# EasyEDA schematic SCH_mysplitkeyboard-right(sub).json
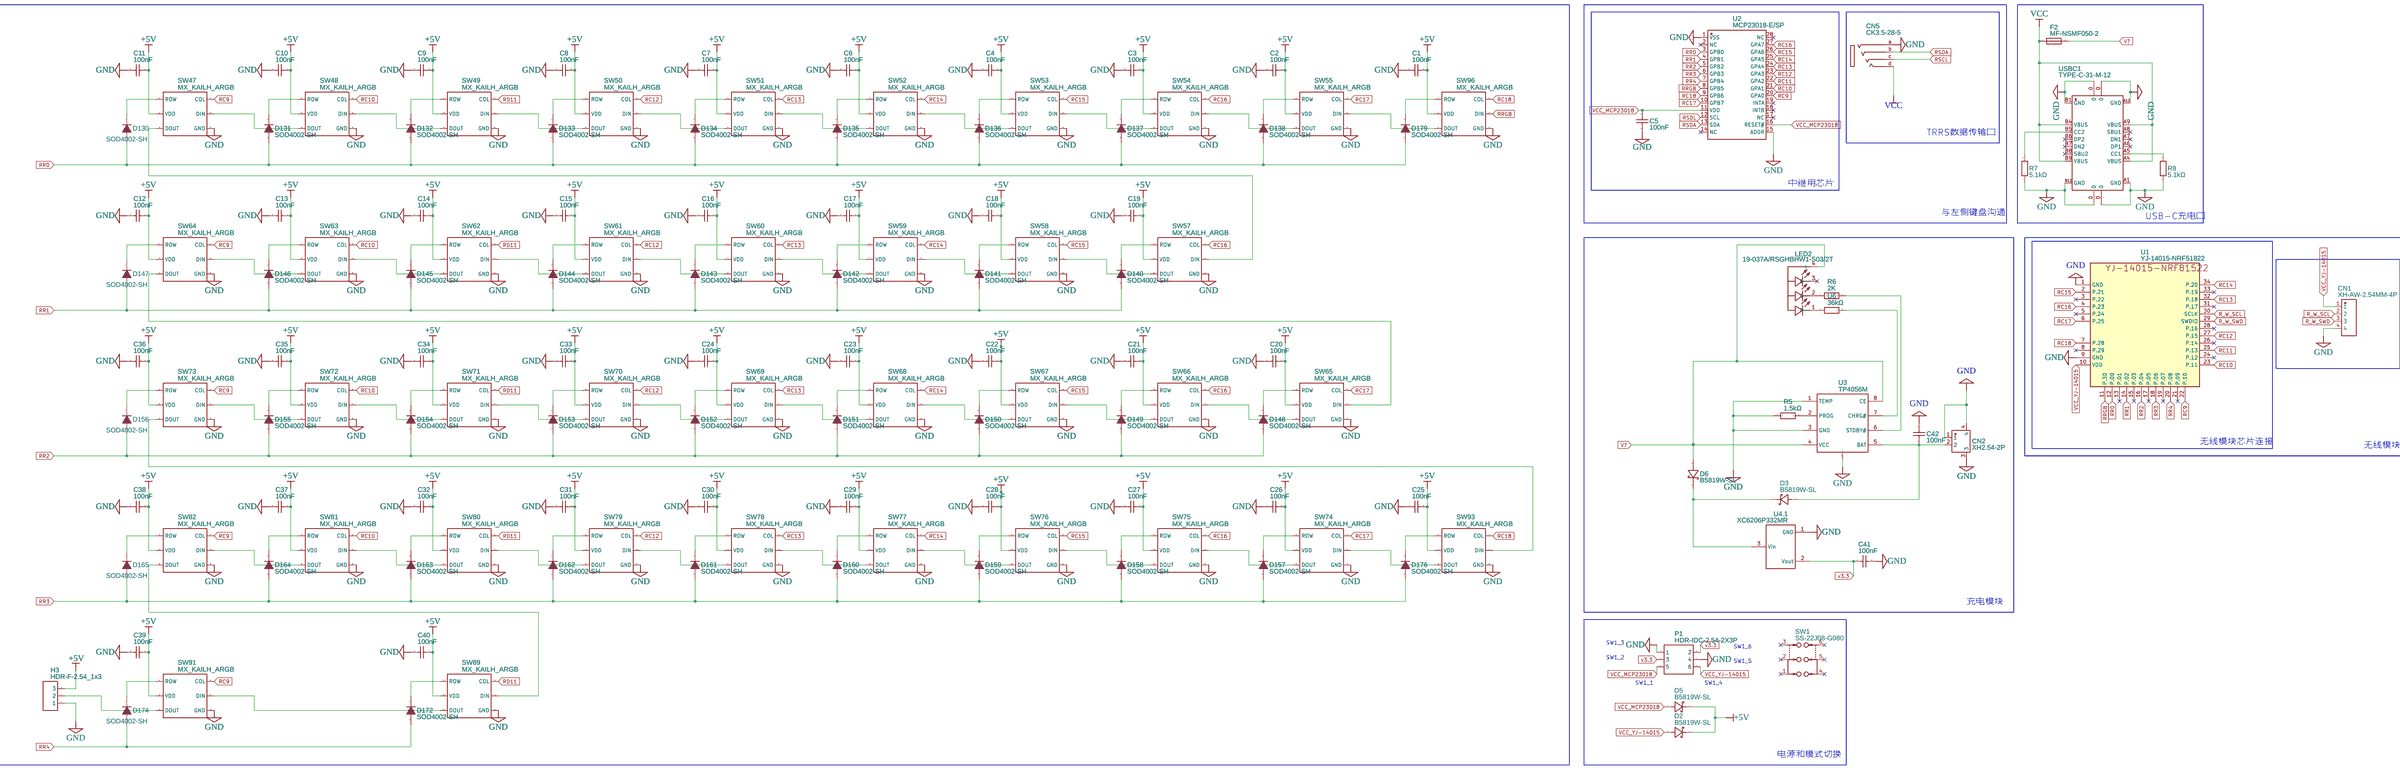
[diagram p0: schematic sheet]

## Parts
C1  100nF  [C0805]
C2  100nF  [C0805]
C3  100nF  [C0805]
C4  100nF  [C0805]
C5  100nF  [C0805]
C6  100nF  [C0805]
C7  100nF  [C0805]
C8  100nF  [C0805]
C9  100nF  [C0805]
C10  100nF  [C0805]
C11  100nF  [C0805]
C12  100nF  [C0805]
C13  100nF  [C0805]
C14  100nF  [C0805]
C15  100nF  [C0805]
C16  100nF  [C0805]
C17  100nF  [C0805]
C18  100nF  [C0805]
C19  100nF  [C0805]
C20  100nF  [C0805]
C21  100nF  [C0805]
C22  100nF  [C0805]
C23  100nF  [C0805]
C24  100nF  [C0805]
C25  100nF  [C0805]
C26  100nF  [C0805]
C27  100nF  [C0805]
C28  100nF  [C0805]
C29  100nF  [C0805]
C30  100nF  [C0805]
C31  100nF  [C0805]
C32  100nF  [C0805]
C33  100nF  [C0805]
C34  100nF  [C0805]
C35  100nF  [C0805]
C36  100nF  [C0805]
C37  100nF  [C0805]
C38  100nF  [C0805]
C39  100nF  [C0805]
C40  100nF  [C0805]
C41  100nF  [C0805]
C42  100nF  [C0805]
CN1  XH-AW-2.54MM-4P  [CONN-TH_4P-P2.54_XH-AW-2.54MM-4P]
CN2  XH2.54-2P  [CONN-SMD_2P-P2.50-WT]
CN5  CK3.5-28-5  [AUDIO-TH_CK3.5-28-5]
D2  B5819W-SL  [SOD-123_L2.8-W1.8-LS3.7-RD]
D3  B5819W-SL  [SOD-123_L2.8-W1.8-LS3.7-RD]
D5  B5819W-SL  [SOD-123_L2.8-W1.8-LS3.7-RD]
D6  B5819W-SL  [SOD-123_L2.8-W1.8-LS3.7-RD]
D130  SOD4002-SH  [SOD-123F_L2.8-W1.8-LS3.7-RD]
D131  SOD4002-SH  [SOD-123F_L2.8-W1.8-LS3.7-RD]
D132  SOD4002-SH  [SOD-123F_L2.8-W1.8-LS3.7-RD]
D133  SOD4002-SH  [SOD-123F_L2.8-W1.8-LS3.7-RD]
D134  SOD4002-SH  [SOD-123F_L2.8-W1.8-LS3.7-RD]
D135  SOD4002-SH  [SOD-123F_L2.8-W1.8-LS3.7-RD]
D136  SOD4002-SH  [SOD-123F_L2.8-W1.8-LS3.7-RD]
D137  SOD4002-SH  [SOD-123F_L2.8-W1.8-LS3.7-RD]
D138  SOD4002-SH  [SOD-123F_L2.8-W1.8-LS3.7-RD]
D140  SOD4002-SH  [SOD-123F_L2.8-W1.8-LS3.7-RD]
D141  SOD4002-SH  [SOD-123F_L2.8-W1.8-LS3.7-RD]
D142  SOD4002-SH  [SOD-123F_L2.8-W1.8-LS3.7-RD]
D143  SOD4002-SH  [SOD-123F_L2.8-W1.8-LS3.7-RD]
D144  SOD4002-SH  [SOD-123F_L2.8-W1.8-LS3.7-RD]
D145  SOD4002-SH  [SOD-123F_L2.8-W1.8-LS3.7-RD]
D146  SOD4002-SH  [SOD-123F_L2.8-W1.8-LS3.7-RD]
D147  SOD4002-SH  [SOD-123F_L2.8-W1.8-LS3.7-RD]
D148  SOD4002-SH  [SOD-123F_L2.8-W1.8-LS3.7-RD]
D149  SOD4002-SH  [SOD-123F_L2.8-W1.8-LS3.7-RD]
D150  SOD4002-SH  [SOD-123F_L2.8-W1.8-LS3.7-RD]
D151  SOD4002-SH  [SOD-123F_L2.8-W1.8-LS3.7-RD]
D152  SOD4002-SH  [SOD-123F_L2.8-W1.8-LS3.7-RD]
D153  SOD4002-SH  [SOD-123F_L2.8-W1.8-LS3.7-RD]
D154  SOD4002-SH  [SOD-123F_L2.8-W1.8-LS3.7-RD]
D155  SOD4002-SH  [SOD-123F_L2.8-W1.8-LS3.7-RD]
D156  SOD4002-SH  [SOD-123F_L2.8-W1.8-LS3.7-RD]
D157  SOD4002-SH  [SOD-123F_L2.8-W1.8-LS3.7-RD]
D158  SOD4002-SH  [SOD-123F_L2.8-W1.8-LS3.7-RD]
D159  SOD4002-SH  [SOD-123F_L2.8-W1.8-LS3.7-RD]
D160  SOD4002-SH  [SOD-123F_L2.8-W1.8-LS3.7-RD]
D161  SOD4002-SH  [SOD-123F_L2.8-W1.8-LS3.7-RD]
D162  SOD4002-SH  [SOD-123F_L2.8-W1.8-LS3.7-RD]
D163  SOD4002-SH  [SOD-123F_L2.8-W1.8-LS3.7-RD]
D164  SOD4002-SH  [SOD-123F_L2.8-W1.8-LS3.7-RD]
D165  SOD4002-SH  [SOD-123F_L2.8-W1.8-LS3.7-RD]
D172  SOD4002-SH  [SOD-123F_L2.8-W1.8-LS3.7-RD]
D174  SOD4002-SH  [SOD-123F_L2.8-W1.8-LS3.7-RD]
D176  SOD4002-SH  [SOD-123F_L2.8-W1.8-LS3.7-RD]
D179  SOD4002-SH  [SOD-123F_L2.8-W1.8-LS3.7-RD]
F2  MF-NSMF050-2  [F1206]
H3  HDR-F-2.54_1x3  [HDR-F-2.54_1X3]
LED2  19-037A/RSGHBHW1-S03/2T  [LED-ARRAY-SMD_4P-L1.6-W1.6-TR_EVERLIGHT_RSGHBHW1-S03]
P1  HDR-IDC-2.54-2X3P  [IDC-TH_6P-P2.54_C11214]
R5  1.5kΩ  [R0805]
R6  2K  [R0805]
R7  5.1kΩ  [R0805]
R8  5.1kΩ  [R0805]
SW1  SS-22J08-G080  [SW-TH_G-SWITCH_SS-22J08-G080]
SW47  MX_KAILH_ARGB  [MX_KAILH_ARGB_V1]
SW48  MX_KAILH_ARGB  [MX_KAILH_ARGB_V1]
SW49  MX_KAILH_ARGB  [MX_KAILH_ARGB_V1]
SW50  MX_KAILH_ARGB  [MX_KAILH_ARGB_V1]
SW51  MX_KAILH_ARGB  [MX_KAILH_ARGB_V1]
SW52  MX_KAILH_ARGB  [MX_KAILH_ARGB_V1]
SW53  MX_KAILH_ARGB  [MX_KAILH_ARGB_V1]
SW54  MX_KAILH_ARGB  [MX_KAILH_ARGB_V1]
SW55  MX_KAILH_ARGB  [MX_KAILH_ARGB_V1]
SW57  MX_KAILH_ARGB  [MX_KAILH_ARGB_V1]
SW58  MX_KAILH_ARGB  [MX_KAILH_ARGB_V1]
SW59  MX_KAILH_ARGB  [MX_KAILH_ARGB_V1]
SW60  MX_KAILH_ARGB  [MX_KAILH_ARGB_V1]
SW61  MX_KAILH_ARGB  [MX_KAILH_ARGB_V1]
SW62  MX_KAILH_ARGB  [MX_KAILH_ARGB_V1]
SW63  MX_KAILH_ARGB  [MX_KAILH_ARGB_V1]
SW64  MX_KAILH_ARGB  [MX_KAILH_ARGB_V1]
SW65  MX_KAILH_ARGB  [MX_KAILH_ARGB_V1]
SW66  MX_KAILH_ARGB  [MX_KAILH_ARGB_V1]
SW67  MX_KAILH_ARGB  [MX_KAILH_ARGB_V1]
SW68  MX_KAILH_ARGB  [MX_KAILH_ARGB_V1]
SW69  MX_KAILH_ARGB  [MX_KAILH_ARGB_V1]
SW70  MX_KAILH_ARGB  [MX_KAILH_ARGB_V1]
SW71  MX_KAILH_ARGB  [MX_KAILH_ARGB_V1]
SW72  MX_KAILH_ARGB  [MX_KAILH_ARGB_V1]
SW73  MX_KAILH_ARGB  [MX_KAILH_ARGB_V1]
SW74  MX_KAILH_ARGB  [MX_KAILH_ARGB_V1]
SW75  MX_KAILH_ARGB  [MX_KAILH_ARGB_V1]
SW76  MX_KAILH_ARGB  [MX_KAILH_ARGB_V1]
SW77  MX_KAILH_ARGB  [MX_KAILH_ARGB_V1]
SW78  MX_KAILH_ARGB  [MX_KAILH_ARGB_V1]
SW79  MX_KAILH_ARGB  [MX_KAILH_ARGB_V1]
SW80  MX_KAILH_ARGB  [MX_KAILH_ARGB_V1]
SW81  MX_KAILH_ARGB  [MX_KAILH_ARGB_V1]
SW82  MX_KAILH_ARGB  [MX_KAILH_ARGB_V1]
SW89  MX_KAILH_ARGB  [MX_KAILH_ARGB_V1]
SW91  MX_KAILH_ARGB  [MX_KAILH_ARGB_V1]
SW93  MX_KAILH_ARGB  [MX_KAILH_ARGB_V1]
SW96  MX_KAILH_ARGB  [MX_KAILH_ARGB_V1]
U1  YJ-14015-NRF51822  [YJ-14015-NRF51822]
U2  MCP23018-E/SP  [SPDIP-28_L34.7-W7.2-P2.54-LS7.9-BL]
U3  TP4056M  [MSOP-8_L3.0-W3.0-P0.65-LS5.0-BL-EP]
U4  XC6206P332MR  [SOT-23-3_L2.9-W1.6-P1.90-LS2.8-BR]  (section 1)
U6  36kΩ  [R0805]
USBC1  TYPE-C-31-M-12  [USB-C_SMD-TYPE-C-31-M-12]

## Library data of the parts
C1-C42 = C0805C104K5RACAUTO: Supplier: LCSC; Manufacturer: KEMET; Contributor: LCSC; Supplier Part: C129641; JLCPCB Part Class: Extended Part
CN1 = XH-AW-2.54MM-4P: Supplier: LCSC; Supplier Part: C9900018797; Manufacturer: null; JLCPCB Part Class: Extended Part; Contributor: lcsc
CN2 = XH2.54-2P: Supplier: LCSC; Supplier Part: C9900004348; Manufacturer: 深圳华利; link: https://item.taobao.com/item.htm?id=584598398852&price=0.1-0.18&sourceType=item&detailSharePosition=interactBar&sourceType=item&suid=31843e8f-a3cd-4e51-8449-826e7ea887a9&shareUniqueId=14191166517&ut_s; Contributor: LCSC; JLCPCB Part Class: Extended Part
CN5 = CK3.5-28-5: Supplier: LCSC; Supplier Part: C718048; Manufacturer: JINJIA; Contributor: LCSC; JLCPCB Part Class: Extended Part
D2 D3 D5 D6 = B5819W-SL: Supplier: LCSC; Supplier Part: C779676; Manufacturer: ZRE; Contributor: LCSC; JLCPCB Part Class: Extended Part
D130-D138 D140-D165 D172 D174 D176 D179 = SOD4002-SH: Supplier: LCSC; Manufacturer: LRC; Contributor: LCSC; Supplier Part: C154996; JLCPCB Part Class: Extended Part
F2 = MF-NSMF050-2: Supplier: LCSC; Manufacturer: BOURNS; Supplier Part: C75464; JLCPCB Part Class: Extended Part
H3 = HDR-F-2.54_1x3: Supplier Part: C146690; Supplier: LCSC; Contributor: LCEDA_Lib
LED2 = 19-037A/RSGHBHW1-S03/2T: Supplier: LCSC; Supplier Part: C282128; Manufacturer: Everlight Elec; Contributor: LCSC; JLCPCB Part Class: Extended Part
P1 = HDR-IDC-2.54-2X3P: Supplier: LCSC; Manufacturer: BOOMELE; Manufacturer Part: 2X3 2.54mm IDC Box; image: //image.lceda.cn/szlcsc/C11214.jpg; Supplier Part: C11214
R5 = RMC08051.5K1%N: Supplier: LCSC; Supplier Part: C269739; Manufacturer: Tyohm; Resistance (Ohms): 1.5K; Contributor: LCSC; JLCPCB Part Class: Extended Part
R6 = CR0805-FX-2001ELF: Supplier: LCSC; Supplier Part: C203834; Manufacturer: BOURNS; Contributor: LCSC; JLCPCB Part Class: Extended Part; Resistance: 2kΩ
R7 R8 = AECR0805F5K10K9: Supplier: LCSC; Supplier Part: C328405; Manufacturer: ResistorToday; Resistance (Ohms): 5.1K; Contributor: LCSC; JLCPCB Part Class: Extended Part
SW1 = SS-22J08-G080: Supplier: LCSC; Supplier Part: C2848898; Manufacturer: G-Switch(品赞); Contributor: LCSC
SW47-SW55 SW57-SW82 SW89 SW91 SW93 SW96 = MX_KAILH_ARGB_REVERSABLE: Contributor: Dusty Kuban
U1 = YJ-14015-NRF51822: Supplier: AliExpress; Contributor: slorenm
U2 = MCP23018-E/SP: Supplier: LCSC; Supplier Part: C647353; Manufacturer: Microchip Tech; Contributor: LCSC; JLCPCB Part Class: Extended Part
U3 = TP4056M: Supplier: LCSC; Manufacturer: TOPPOWER; Supplier Part: C21417; JLCPCB Part Class: Extended Part
U4 = XC6206P332MR: Supplier: LCSC; Manufacturer: TOREX; Supplier Part: C5446; JLCPCB Part Class: Basic Part; subpart_no: 1
U6 = HPCR0805F36K0K9: Supplier: LCSC; Supplier Part: C365294; Manufacturer: ResistorToday; Resistance (Ohms): 36K; Contributor: LCSC; JLCPCB Part Class: Extended Part
USBC1 = TYPE-C-31-M-12: Supplier: LCSC; Supplier Part: C165948; Manufacturer: Rectangular Connectors - Contacts; Contributor: LCSC; JLCPCB Part Class: Extended Part

## Nets
+5V: C1.1 C2.1 C3.1 C4.1 C6.1 C7.1 C8.1 C9.1 C10.1 C11.1 C12.1 C13.1 C14.1 C15.1 C16.1 C17.1 C18.1 C19.1 C20.1 C21.1 C22.1 C23.1 C24.1 C25.1 C26.1 C27.1 C28.1 C29.1 C30.1 C31.1 C32.1 C33.1 C34.1 C35.1 C36.1 C37.1 C38.1 C39.1 C40.1 D2.1(C) D5.1(C) H3.3 SW47.VDD SW48.VDD SW49.VDD SW50.VDD SW51.VDD SW52.VDD SW53.VDD SW54.VDD SW55.VDD SW57.VDD SW58.VDD SW59.VDD SW60.VDD SW61.VDD SW62.VDD SW63.VDD SW64.VDD SW65.VDD SW66.VDD SW67.VDD SW68.VDD SW69.VDD SW70.VDD SW71.VDD SW72.VDD SW73.VDD SW74.VDD SW75.VDD SW76.VDD SW77.VDD SW78.VDD SW79.VDD SW80.VDD SW81.VDD SW82.VDD SW89.VDD SW91.VDD SW93.VDD SW96.VDD
GND: C1.2 C2.2 C3.2 C4.2 C5.2 C6.2 C7.2 C8.2 C9.2 C10.2 C11.2 C12.2 C13.2 C14.2 C15.2 C16.2 C17.2 C18.2 C19.2 C20.2 C21.2 C22.2 C23.2 C24.2 C25.2 C26.2 C27.2 C28.2 C29.2 C30.2 C31.2 C32.2 C33.2 C34.2 C35.2 C36.2 C37.2 C38.2 C39.2 C40.2 C41.2 C42.2 CN1.4 CN2.1 CN2.3 CN2.4 CN5.a H3.1 P1.1 P1.4 R5.1 R7.1 R8.1 SW47.GND SW48.GND SW49.GND SW50.GND SW51.GND SW52.GND SW53.GND SW54.GND SW55.GND SW57.GND SW58.GND SW59.GND SW60.GND SW61.GND SW62.GND SW63.GND SW64.GND SW65.GND SW66.GND SW67.GND SW68.GND SW69.GND SW70.GND SW71.GND SW72.GND SW73.GND SW74.GND SW75.GND SW76.GND SW77.GND SW78.GND SW79.GND SW80.GND SW81.GND SW82.GND SW89.GND SW91.GND SW93.GND SW96.GND U1.1(GND) U1.9(GND) U2.1(VSS) U2.15(ADDR) U3.1(TEMP) U3.3(GND) U3.9 U4.1(GND) USBC1.0 USBC1.A1(GND) USBC1.A12(GND) USBC1.B1(GND) USBC1.B12(GND)
v3.3: C41.1 P1.2 P1.3 U4.2(Vout)
VCC: CN5.d F2.1 USBC1.A4(VBUS) USBC1.A9(VBUS) USBC1.B4(VBUS) USBC1.B9(VBUS)
VCC_MCP23018: C5.1 D5.2(A) P1.5 U2.11(VDD) U2.16(RESET#)
VCC_YJ-14015: CN1.1 D2.2(A) P1.6 U1.10(VDD)
R_W_SCL: CN1.2 U1.30(SCLK)
R_W_SWD: CN1.3 U1.29(SWDIO)
RC9: SW47.COL SW64.COL SW73.COL SW82.COL SW91.COL U1.22(P.10) U2.20(GPA0)
RC10: SW48.COL SW63.COL SW72.COL SW81.COL U1.23(P.11) U2.21(GPA1)
RC11: U1.25(P.13) U2.22(GPA2)
RC12: SW50.COL SW61.COL SW70.COL SW79.COL U1.27(P.15) U2.23(GPA3)
RC13: SW51.COL SW60.COL SW69.COL SW78.COL U1.32(P.18) U2.24(GPA4)
RC14: SW52.COL SW59.COL SW68.COL SW77.COL U1.34(P.20) U2.25(GPA5)
RC15: SW53.COL SW58.COL SW67.COL SW76.COL U1.2(P.21) U2.26(GPA6)
RC16: SW54.COL SW57.COL SW66.COL SW75.COL U1.4(P.23) U2.27(GPA7)
RC17: SW55.COL SW65.COL SW74.COL U1.6(P.25) U2.10(GPB7)
RC18: SW93.COL SW96.COL U1.7(P.28) U2.9(GPB6)
RD11: SW49.COL SW62.COL SW71.COL SW80.COL SW89.COL
RR0: D130.2(A) D131.2(A) D132.2(A) D133.2(A) D134.2(A) D135.2(A) D136.2(A) D137.2(A) D138.2(A) D179.2(A) U1.12(P.00) U2.3(GPB0)
RR1: D140.2(A) D141.2(A) D142.2(A) D143.2(A) D144.2(A) D145.2(A) D146.2(A) D147.2(A) U1.14(P.02) U2.4(GPB1)
RR2: D148.2(A) D149.2(A) D150.2(A) D151.2(A) D152.2(A) D153.2(A) D154.2(A) D155.2(A) D156.2(A) U1.16(P.04) U2.5(GPB2)
RR3: D157.2(A) D158.2(A) D159.2(A) D160.2(A) D161.2(A) D162.2(A) D163.2(A) D164.2(A) D165.2(A) D176.2(A) U1.18(P.06) U2.6(GPB3)
RR4: D172.2(A) D174.2(A) U1.20(P.08) U2.7(GPB4)
RRGB: SW96.DIN U1.11(P.30) U2.8(GPB5)
RSCL: CN5.c
RSDA: CN5.b U2.13(SDA)
RSDL: U2.12(SCL)
V?: D6.2(A) F2.2 LED2.4(+) U3.4(VCC) U3.8(CE)
Net-(C42-1): C42.1 CN2.2 D3.2(A) U3.5(BAT)
Net-(D3-1): D3.1(C) D6.1(C) U4.3(Vin)
Net-(D130-1): D130.1(K) SW47.ROW
Net-(D131-1): D131.1(K) SW48.ROW
Net-(D132-1): D132.1(K) SW49.ROW
Net-(D133-1): D133.1(K) SW50.ROW
Net-(D134-1): D134.1(K) SW51.ROW
Net-(D135-1): D135.1(K) SW52.ROW
Net-(D136-1): D136.1(K) SW53.ROW
Net-(D137-1): D137.1(K) SW54.ROW
Net-(D138-1): D138.1(K) SW55.ROW
Net-(D140-1): D140.1(K) SW57.ROW
Net-(D141-1): D141.1(K) SW58.ROW
Net-(D142-1): D142.1(K) SW59.ROW
Net-(D143-1): D143.1(K) SW60.ROW
Net-(D144-1): D144.1(K) SW61.ROW
Net-(D145-1): D145.1(K) SW62.ROW
Net-(D146-1): D146.1(K) SW63.ROW
Net-(D147-1): D147.1(K) SW64.ROW
Net-(D148-1): D148.1(K) SW65.ROW
Net-(D149-1): D149.1(K) SW66.ROW
Net-(D150-1): D150.1(K) SW67.ROW
Net-(D151-1): D151.1(K) SW68.ROW
Net-(D152-1): D152.1(K) SW69.ROW
Net-(D153-1): D153.1(K) SW70.ROW
Net-(D154-1): D154.1(K) SW71.ROW
Net-(D155-1): D155.1(K) SW72.ROW
Net-(D156-1): D156.1(K) SW73.ROW
Net-(D157-1): D157.1(K) SW74.ROW
Net-(D158-1): D158.1(K) SW75.ROW
Net-(D159-1): D159.1(K) SW76.ROW
Net-(D160-1): D160.1(K) SW77.ROW
Net-(D161-1): D161.1(K) SW78.ROW
Net-(D162-1): D162.1(K) SW79.ROW
Net-(D163-1): D163.1(K) SW80.ROW
Net-(D164-1): D164.1(K) SW81.ROW
Net-(D165-1): D165.1(K) SW82.ROW
Net-(D172-1): D172.1(K) SW89.ROW
Net-(D174-1): D174.1(K) SW91.ROW
Net-(D176-1): D176.1(K) SW93.ROW
Net-(D179-1): D179.1(K) SW96.ROW
Net-(H3-2): H3.2 SW91.DOUT
Net-(LED2-1): LED2.1(R-) U6.1
Net-(LED2-2): LED2.2(G-) R6.1
Net-(R5-2): R5.2 U3.2(PROG)
Net-(R6-2): R6.2 U3.6(STDBY#)
Net-(R7-2): R7.2 USBC1.B5(CC2)
Net-(R8-2): R8.2 USBC1.A5(CC1)
Net-(SW47-DIN): SW47.DIN SW48.DOUT
Net-(SW47-DOUT): SW47.DOUT SW57.DIN
Net-(SW48-DIN): SW48.DIN SW49.DOUT
Net-(SW49-DIN): SW49.DIN SW50.DOUT
Net-(SW50-DIN): SW50.DIN SW51.DOUT
Net-(SW51-DIN): SW51.DIN SW52.DOUT
Net-(SW52-DIN): SW52.DIN SW53.DOUT
Net-(SW53-DIN): SW53.DIN SW54.DOUT
Net-(SW54-DIN): SW54.DIN SW55.DOUT
Net-(SW55-DIN): SW55.DIN SW96.DOUT
Net-(SW57-DOUT): SW57.DOUT SW58.DIN
Net-(SW58-DOUT): SW58.DOUT SW59.DIN
Net-(SW59-DOUT): SW59.DOUT SW60.DIN
Net-(SW60-DOUT): SW60.DOUT SW61.DIN
Net-(SW61-DOUT): SW61.DOUT SW62.DIN
Net-(SW62-DOUT): SW62.DOUT SW63.DIN
Net-(SW63-DOUT): SW63.DOUT SW64.DIN
Net-(SW64-DOUT): SW64.DOUT SW65.DIN
Net-(SW65-DOUT): SW65.DOUT SW66.DIN
Net-(SW66-DOUT): SW66.DOUT SW67.DIN
Net-(SW67-DOUT): SW67.DOUT SW68.DIN
Net-(SW68-DOUT): SW68.DOUT SW69.DIN
Net-(SW69-DOUT): SW69.DOUT SW70.DIN
Net-(SW70-DOUT): SW70.DOUT SW71.DIN
Net-(SW71-DOUT): SW71.DOUT SW72.DIN
Net-(SW72-DOUT): SW72.DOUT SW73.DIN
Net-(SW73-DOUT): SW73.DOUT SW93.DIN
Net-(SW74-DIN): SW74.DIN SW93.DOUT
Net-(SW74-DOUT): SW74.DOUT SW75.DIN
Net-(SW75-DOUT): SW75.DOUT SW76.DIN
Net-(SW76-DOUT): SW76.DOUT SW77.DIN
Net-(SW77-DOUT): SW77.DOUT SW78.DIN
Net-(SW78-DOUT): SW78.DOUT SW79.DIN
Net-(SW79-DOUT): SW79.DOUT SW80.DIN
Net-(SW80-DOUT): SW80.DOUT SW81.DIN
Net-(SW81-DOUT): SW81.DOUT SW82.DIN
Net-(SW82-DOUT): SW82.DOUT SW89.DIN
Net-(SW89-DOUT): SW89.DOUT SW91.DIN
Net-(U3-7): U3.7(CHRG#) U6.2

Not connected (* = marked no-connect by the designer): LED2 3(B-)*; SW1 1* 2* 3* 4* 5* 6*; U1 3(P.22)* 5(P.24)* 8(P.29)* 13(P.01)* 15(P.03)* 17(P.05)* 19(P.07)* 21(P.09)* 24(P.12)* 26(P.14)* 28(P.16)* 31(P.17)* 33(P.19)*; U2 2(NC)* 14(NC)* 17(NC)* 18(INTB)* 19(INTA)* 28(NC)*; USBC1 A6(DP1)* A7(DN1)* A8(SBU1)* B6(DP2)* B7(DN2)* B8(SBU2)*

## Notes on the sheet
- TRRS数据传输口
- 中继用芯片
- 与左侧键盘沟通
- USB-C充电口
- 无线模块芯片连接
- 无线模块
- 充电模块
- SW1_3
- SW1_6
- SW1_2
- SW1_5
- SW1_1
- SW1_4
- 电源和模式切换
